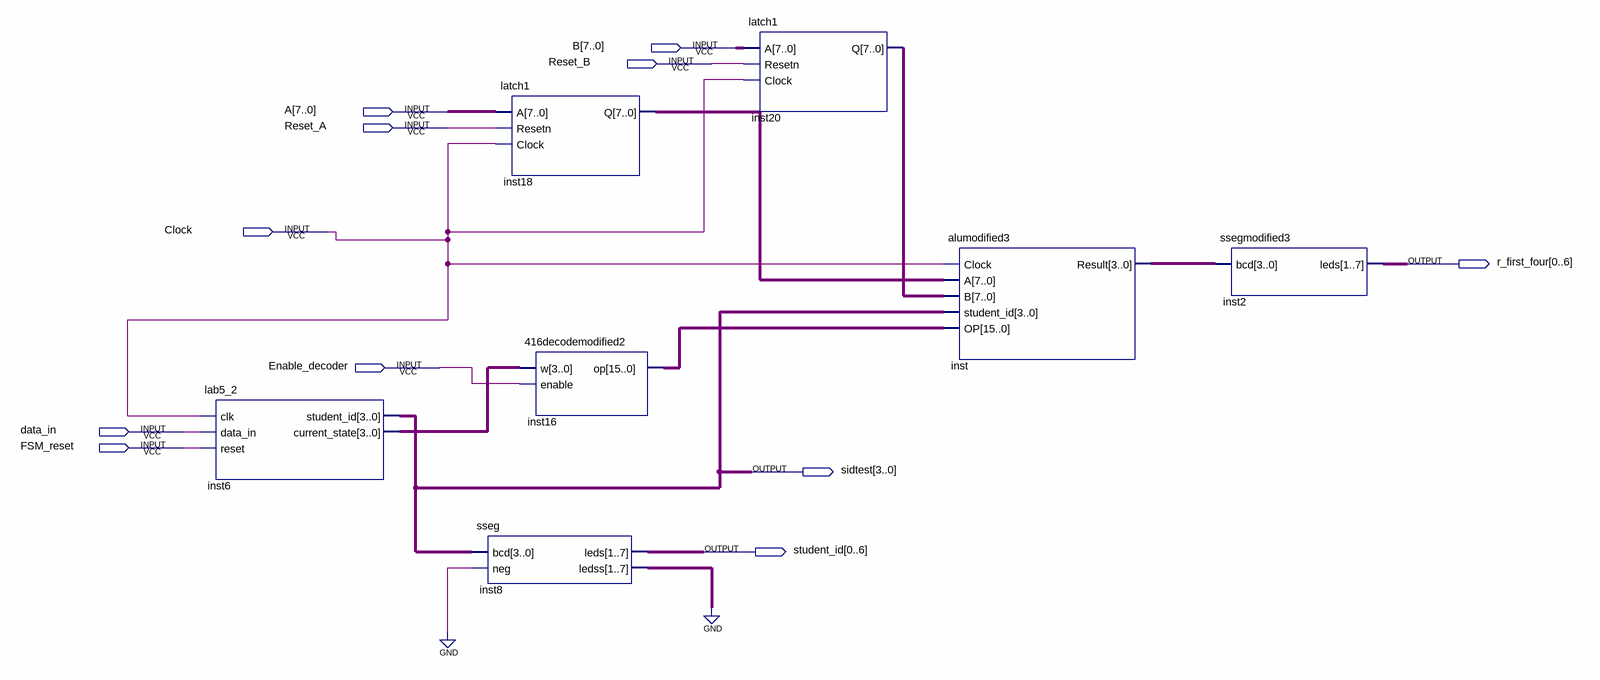
[diagram p0: schematic sheet]
// Quartus schematic modifiedcontrolunit.bdf as structural Verilog: 7 symbols, 11 pins
module modifiedcontrolunit (
  input  [7:0] B,
  input  Reset_B,
  input  [7:0] A,
  input  Reset_A,
  input  Clock,
  input  Enable_decoder,
  input  data_in,
  input  FSM_reset,
  output [0:6] r_first_four,
  output [3:0] sidtest,
  output [0:6] student_id
);

  wire [3:0] inst6_current_state, inst_result;
  wire [6:0] inst8_ledss;
  wire [7:0] inst18_q, inst20_q;
  wire [15:0] inst16_op;

  lab5_2 inst6 (
    .clk(Clock), .data_in(data_in), .reset(FSM_reset), .student_id(sidtest),
    .current_state(inst6_current_state));
  sseg inst8 (.bcd(sidtest), .neg(1'b0), .leds(student_id), .ledss(inst8_ledss));
  latch1 inst18 (.A(A), .Resetn(Reset_A), .Clock(Clock), .Q(inst18_q));
  \416decodemodified2  inst16 (.w(inst6_current_state), .enable(Enable_decoder), .op(inst16_op));
  latch1 inst20 (.A(B), .Resetn(Reset_B), .Clock(Clock), .Q(inst20_q));
  alumodified3 inst (
    .Clock(Clock), .A(inst18_q), .B(inst20_q), .student_id(sidtest), .OP(inst16_op), .Result(inst_result));
  ssegmodified3 inst2 (.bcd(inst_result), .leds(r_first_four));
  // also tied to GND on the sheet: {inst8_ledss[0], inst8_ledss[1], inst8_ledss[2], inst8_ledss[3], inst8_ledss[4], inst8_ledss[5], inst8_ledss[6]}
endmodule
